# Altium schematic sheet E-41 LIDAR Dev Brd.SchDoc: E-41 LIDAR Dev Board
size B; DrawnBy: Jeremie Boulianne; Organization: EZ-Robot Inc.; Address1: Unit 10, 6120 - 11 St. SE; Address2: Calgary, AB; Address3: T2H 2L7; Address4: Canada; Revision: 5
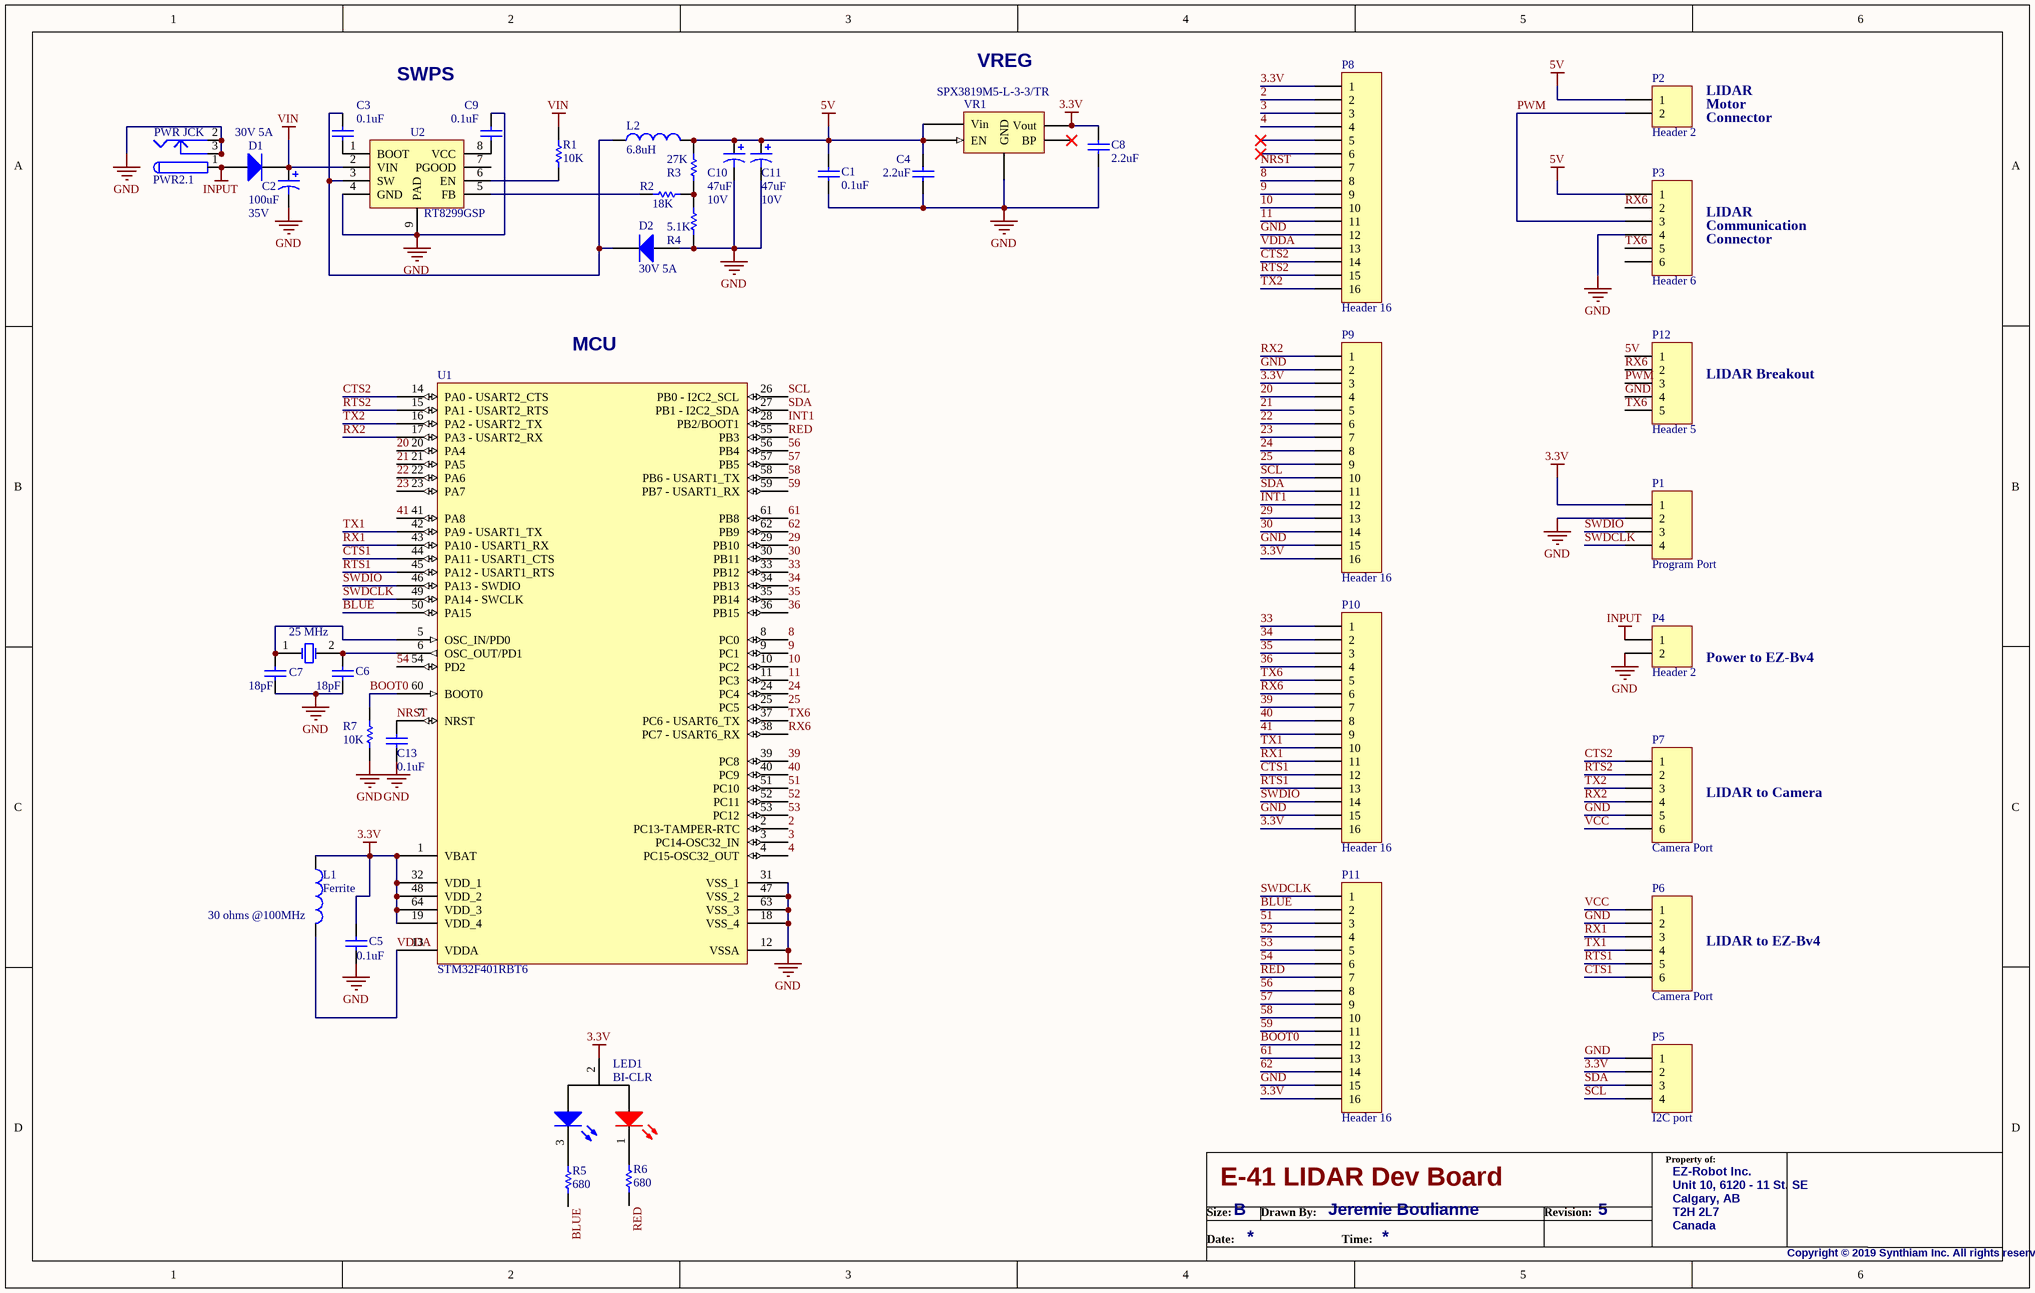
[diagram p0: E-41 LIDAR Dev Brd.SchDoc]

## Parts
25_MHz  XTAL  [Crystal]  (value not drawn)
C1  value 0.1uF  [0603 TIGHT]  (hidden comment: Cap)
C2  35V  value 100uF  [SMD Capacitor 220uf 16V]
C3  0.1uF  [0603 TIGHT]
C4  value 2.2uF  [0603 TIGHT]  (hidden comment: Cap)
C5  value 0.1uF  [0603 TIGHT]  (hidden comment: Cap)
C6  value 18pF  [0603 TIGHT]  (hidden comment: Cap)
C7  value 18pF  [0603 TIGHT]  (hidden comment: Cap)
C8  value 2.2uF  [0603 TIGHT]  (hidden comment: Cap)
C9  value 0.1uF  [0603 TIGHT]  (hidden comment: Cap)
C10  10V  value 47uF  [1206]
C11  10V  value 47uF  [1206]
C13  value 0.1uF  [0603 TIGHT]  (hidden comment: Cap)
D1  30V 5A  [DIODE SOD-128]
D2  30V 5A  [DIODE SOD-128]
L1  Ferrite  value 30 ohms @100MHz  [0603 TIGHT]
L2  value 6.8uH  [Inductor SMD]  (hidden comment: Ferrite)
LED1  BI-CLR  [LED BI-COLOR]
P1  Program Port  [HDR1X4]
P2  Header 2  [JST-PH 2-pin]
P3  Header 6  [JST-GH 6-pin]
P4  Header 2  [HDR1X2]
P5  I2C port  [JST-PH 4pin]
P6  Camera Port  [JST-PH 6pin]
P7  Camera Port  [JST-PH 6pin]
P8  Header 16  [HDR1X16]
P9  Header 16  [HDR1X16]
P10  Header 16  [HDR1X16]
P11  Header 16  [HDR1X16]
P12  Header 5  [HDR1X5]
PWR_JCK  PWR2.1  [POWER JACK SLOTS]
R1  value 10K  [0603 TIGHT]  (hidden comment: Res1)
R2  value 18K  [0603 TIGHT]  (hidden comment: Res1)
R3  value 27K  [0603 TIGHT]  (hidden comment: Res1)
R4  value 5.1K  [0603 TIGHT]  (hidden comment: Res1)
R5  value 680  [0603 TIGHT]  (hidden comment: Res1)
R6  value 680  [0603 TIGHT]  (hidden comment: Res1)
R7  value 10K  [0603 TIGHT]  (hidden comment: Res1)
U1  STM32F401RBT6  [LQFP64_M]
U2  RT8299GSP  [SOP-8]
VR1  SPX3819M5-L-3-3/TR  [SOT-25]

## Nets
3.3V: C5.1 C8.1 L1.1 LED1.2 P1.1 P5.2 P8.1 P9.3 P9.16 P10.16 P11.16 U1.1(VBAT) U1.19(VDD_4) U1.32(VDD_1) U1.48(VDD_2) U1.64(VDD_3) VR1.2(Vout)
5V: C1.1 C4.1 C10.1 C11.1 L2.2 P2.1 P3.1 P12.1 R3.2 VR1.4(EN) VR1.5(Vin)
GND: C1.2 C2.2 C4.2 C5.2 C6.2 C7.2 C8.2 C9.1 C10.2 C11.2 C13.2 D2.1(A) P1.2 P3.4 P4.2 P5.1 P6.2 P7.5 P8.12 P9.2 P9.15 P10.15 P11.15 P12.4 PWR_JCK.2 PWR_JCK.2A PWR_JCK.2B PWR_JCK.3 PWR_JCK.3A PWR_JCK.3B R4.1 R7.1 U1.12(VSSA) U1.18(VSS_4) U1.31(VSS_1) U1.47(VSS_2) U1.63(VSS_3) U2.4(GND) U2.9(PAD) VR1.3(GND)
INPUT: D1.1(A) P4.1 PWR_JCK.1 PWR_JCK.1A PWR_JCK.1B
VIN: C2.1 D1.2(K) R1.2 U2.2(VIN)
2: P8.2 U1.2(PC13-TAMPER-RTC)
3: P8.3 U1.3(PC14-OSC32_IN)
4: P8.4 U1.4(PC15-OSC32_OUT)
8: P8.8 U1.8(PC0)
9: P8.9 U1.9(PC1)
10: P8.10 U1.10(PC2)
11: P8.11 U1.11(PC3)
20: P9.4 U1.20(PA4)
21: P9.5 U1.21(PA5)
22: P9.6 U1.22(PA6)
23: P9.7 U1.23(PA7)
24: P9.8 U1.24(PC4)
25: P9.9 U1.25(PC5)
29: P9.13 U1.29(PB10)
30: P9.14 U1.30(PB11)
33: P10.1 U1.33(PB12)
34: P10.2 U1.34(PB13)
35: P10.3 U1.35(PB14)
36: P10.4 U1.36(PB15)
39: P10.7 U1.39(PC8)
40: P10.8 U1.40(PC9)
41: P10.9 U1.41(PA8)
51: P11.3 U1.51(PC10)
52: P11.4 U1.52(PC11)
53: P11.5 U1.53(PC12)
54: P11.6 U1.54(PD2)
56: P11.8 U1.56(PB4)
57: P11.9 U1.57(PB5)
58: P11.10 U1.58(PB6_-_USART1_TX)
59: P11.11 U1.59(PB7_-_USART1_RX)
61: P11.13 U1.61(PB8)
62: P11.14 U1.62(PB9)
BLUE: P11.2 R5.1 U1.50(PA15)
BOOT0: P11.12 R7.2 U1.60(BOOT0)
CTS1: P6.6 P10.12 U1.44(PA11_-_USART1_CTS)
CTS2: P7.1 P8.14 U1.14(PA0_-_USART2_CTS)
INT1: P9.12 U1.28(PB2/BOOT1)
NRST: C13.1 P8.7 U1.7(NRST)
PWM: P2.2 P3.3 P12.3
RED: P11.7 R6.1 U1.55(PB3)
RTS1: P6.5 P10.13 U1.45(PA12_-_USART1_RTS)
RTS2: P7.2 P8.15 U1.15(PA1_-_USART2_RTS)
RX1: P6.3 P10.11 U1.43(PA10_-_USART1_RX)
RX2: P7.4 P9.1 U1.17(PA3_-_USART2_RX)
RX6: P3.2 P10.6 P12.2 U1.38(PC7_-_USART6_RX)
SCL: P5.4 P9.10 U1.26(PB0_-_I2C2_SCL)
SDA: P5.3 P9.11 U1.27(PB1_-_I2C2_SDA)
SWDCLK: P1.4 P11.1 U1.49(PA14_-_SWCLK)
SWDIO: P1.3 P10.14 U1.46(PA13_-_SWDIO)
TX1: P6.4 P10.10 U1.42(PA9_-_USART1_TX)
TX2: P7.3 P8.16 U1.16(PA2_-_USART2_TX)
TX6: P3.5 P10.5 P12.5 U1.37(PC6_-_USART6_TX)
VCC: P6.1 P7.6
VDDA: L1.2 P8.13 U1.13(VDDA)
Net25_MHz_1: 25_MHz.1(OSC1) C7.1 U1.5(OSC_IN/PD0)
Net25_MHz_2: 25_MHz.2(OSC2) C6.1 U1.6(OSC_OUT/PD1)
NetC3_1: C3.1 U2.1(BOOT)
NetC3_2: C3.2 D2.2(K) L2.1 U2.3(SW)
NetC9_2: C9.2 U2.8(VCC)
NetLED1_1: LED1.1 R6.2
NetLED1_3: LED1.3 R5.2
NetR1_1: R1.1 U2.6(EN)
NetR2_1: R2.1 R3.1 R4.2
NetR2_2: R2.2 U2.5(FB)

Not connected (* = marked no-connect by the designer): P3 6; P8 5* 6*; U2 7(PGOOD); VR1 1(BP)*

## Notes on the sheet
- SWPS
- (near VR1) VREG
- LIDAR
- Motor
- Connector
- Communication
- (near U1) MCU
- LIDAR Breakout
- Power to EZ-Bv4
- LIDAR to Camera
- LIDAR to EZ-Bv4
- Property of:
- Size:
- Date:
- B
- Drawn By:
- Time:
- Revision:
- Copyright © 2019 Synthiam Inc. All rights reserved.

## Library data of the parts
25_MHz = XTAL: Crystal Oscillator; Published: 8-Jun-2000; LatestRevisionDate: 17-Jul-2002; LatestRevisionNote: Re-released for DXP Platform.; PackageReference: R38; Publisher: Altium Limited
C1 C3-C9 C13 = Cap: Capacitor; Published: 8-Jun-2000; LatestRevisionDate: 17-Jul-2002; LatestRevisionNote: Re-released for DXP Platform.; PackageReference: RAD-0.3; Publisher: Altium Limited
C2 C10 C11 = Cap Pol1: Polarized Capacitor (Radial); Published: 8-Jun-2000; LatestRevisionDate: 17-Jul-2002; LatestRevisionNote: Re-released for DXP Platform.; PackageReference: RB7.6-15; Publisher: Altium Limited
D1 D2 = Diode 1N4148: High Conductance Fast Diode; Published: 8-Jun-2000; LatestRevisionDate: 17-Jul-2002; LatestRevisionNote: Re-released for DXP Platform.; DatasheetVersion: 1997; PackageReference: DO-35; Publisher: Altium Limited; Code_JEDEC: DO-204-AH; ComponentLink1Description: Manufacturer Link; ComponentLink1URL: http://www.fairchildsemi.com/; ComponentLink2Description: Datasheet; ComponentLink2URL: http://www.fairchildsemi.com/ds/1N%2F1N4148.pdf
L1 L2 = Inductor: Code_IEC: 1005; Published: 8-Jun-2000; LatestRevisionDate: 29-May-2009; LatestRevisionNote: IPC-7351 Footprint Added.; PackageReference: 0402-A; Publisher: Altium Limited; PackageDescription: Chip Inductor; Code_JEITA: 0402
LED1 = LED BI-COLOR
P1 P5 = Header 4: Header, 4-Pin; LatestRevisionDate: 17-Jul-2002; LatestRevisionNote: Re-released for DXP Platform.; Publisher: Altium Limited
P2 P4 = Header 2: Header, 2-Pin; LatestRevisionDate: 17-Jul-2002; LatestRevisionNote: Re-released for DXP Platform.; Publisher: Altium Limited
P3 P6 P7 = Header 6: Header, 6-Pin; LatestRevisionDate: 17-Jul-2002; LatestRevisionNote: Re-released for DXP Platform.; Publisher: Altium Limited
P8-P11 = Header 16: Header, 16-Pin; LatestRevisionDate: 17-Jul-2002; LatestRevisionNote: Re-released for DXP Platform.; Publisher: Altium Limited
P12 = Header 5: Header, 5-Pin; LatestRevisionDate: 17-Jul-2002; LatestRevisionNote: Re-released for DXP Platform.; Publisher: Altium Limited
PWR_JCK = PWR2.5: Low Voltage Power Supply Connector; Published: 17-Dec-2003; DatasheetDocument: 09-May-2002; Publisher: Altium Limited; ComponentLink1Description: Manufacturer Link; ComponentLink1URL: http://domino.kycon.com/internet/Products.html
R1-R7 = Res1: Resistor; Published: 8-Jun-2000; LatestRevisionDate: 17-Jul-2002; LatestRevisionNote: Re-released for DXP Platform.; PackageReference: AXIAL-0.3; Publisher: Altium Limited
U1 = STM32F401R8T6: STM32 ARM MCU; Published: 30-May-2008; DatasheetVersion: rev6, Mar-2008; PackageVersion: Mar-2008; PackageReference: LQFP64; Publisher: Altium Limited; PackageDescription: 64-Pin Low-Profile Quad Flat Pack, 10 x 10 mm Body, 0.5 mm Pitch (LQFP64); ComponentLink1Description: Manufacturer Link; ComponentLink1URL: www.st.com/stm32; ComponentLink2Description: Datasheet; ComponentLink2URL: http://www.st.com/stonline/products/literature/ds/13587.pdf
U2 = RT8299
VR1 = Vreg SOT25